# EAGLE design BMS-Shield rev4 (EAGLE 8.2.2)
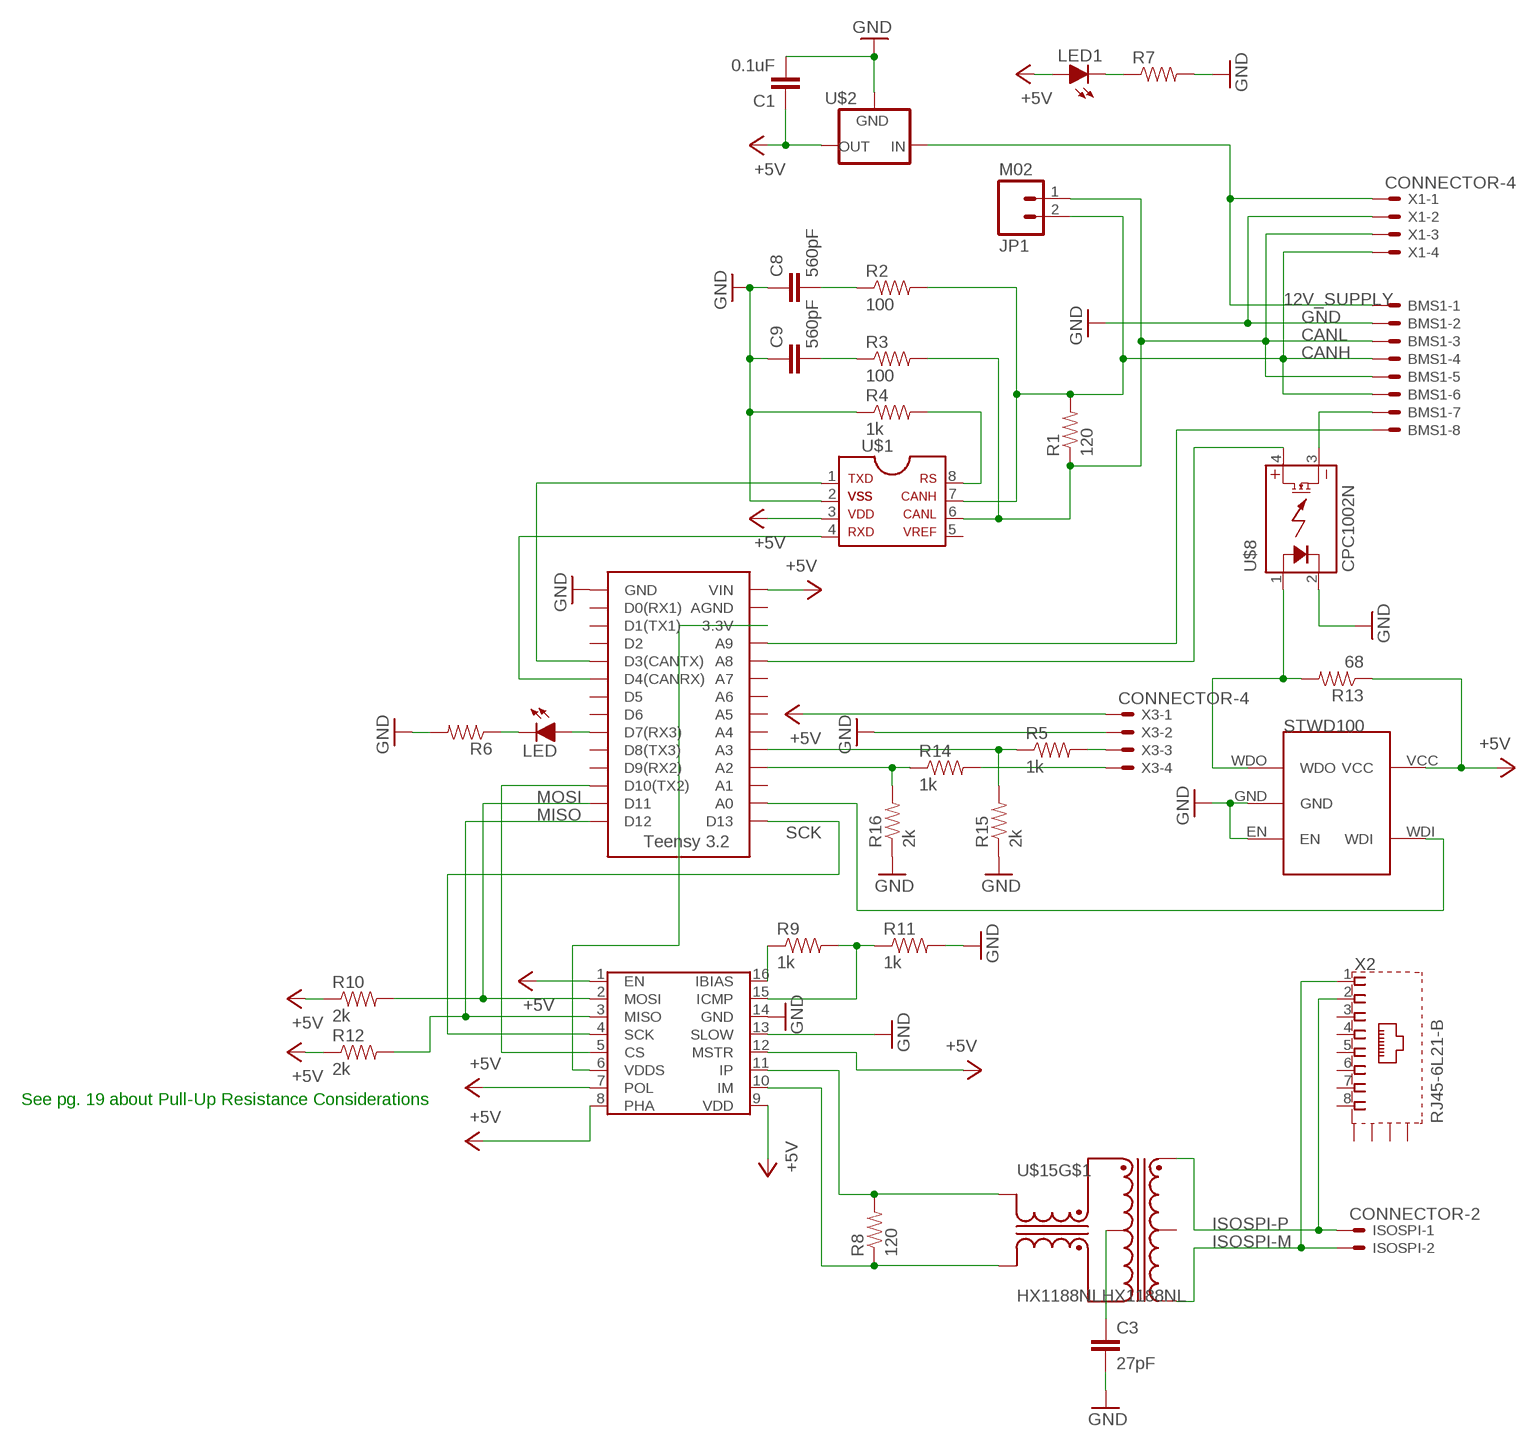
[diagram p0: schematic, sheet 1]

## Parts
BMS1  MINIFIT_5566-8  [MINIFIT_5566-8]
C1  0.1uF  CAP0805  [0805]
C3  27pF  CAP0805  [0805]
C8  560pF  CAP0805  [0805]
C9  560pF  CAP0805  [0805]
ISOSPI  CONNECTOR-2  [MINIFIT_5566-2]
JP1  M02  [1X02]
LED  LED-0805  [LED-805]
LED1  LED-0805  [LED-805]
R1  120  RESISTOR0805-RES  [0805]
R2  100  RESISTOR0805-RES  [0805]
R3  100  RESISTOR0805-RES  [0805]
R4  1k  RESISTOR0805-RES  [0805]
R5  1k  RESISTOR0805-RES  [0805]
R6  RESISTOR0805-RES  [0805]
R7  RESISTOR0805-RES  [0805]
R8  120  RESISTOR0805-RES  [0805]
R9  1k  RESISTOR0805-RES  [0805]
R10  2k  RESISTOR0805-RES  [0805]
R11  1k  RESISTOR0805-RES  [0805]
R12  2k  RESISTOR0805-RES  [0805]
R13  68  RESISTOR0805-RES  [0805]
R14  1k  RESISTOR0805-RES  [0805]
R15  2k  RESISTOR0805-RES  [0805]
R16  2k  RESISTOR0805-RES  [0805]
U$1  MCP2551  [SOIC-08]
U$2  5VREG_LM340-NLM340MPX-5.0/NOPB  [SOT223]
U$3  STWD100  [SOT23-5]
U$6  LTC6820  [MSOP-16]
U$7  TEENSY_3.2_SIMPLE  [TEENSY_3.2_SIMPLE]
U$8  CPC1002N  [SOP04]
U$15  HX1188NLHX1188NL  [HX1188NL]
X1  CONNECTOR-4  [MINIFIT_5566-4]
X2  RJ45-6L21-B  [RJ45-SHIELD1]
X3  CONNECTOR-4  [MINIFIT_5566-4]

## Nets
12V_SUPPLY: BMS1.1 U$2.1(IN) X1.1
+5V: C1.1 LED1.A R10.1 R12.1 R13.1 U$1.3 U$2.3(OUT) U$3.VCC U$6.1(EN) U$6.7(POL) U$6.8(PHA) U$6.9(VDD) U$6.12(MSTR) U$7.VIN X3.1
CANH: BMS1.4 BMS1.6 JP1.2 R1.2 R2.2 U$1.7 X1.4
CANL: BMS1.3 BMS1.5 JP1.1 R1.1 R3.2 U$1.6 X1.3
GND: BMS1.2 C1.2 C3.2 C8.1 C9.1 R4.1 R6.2 R7.2 R11.2 R15.1 R16.1 U$1.2 U$2.2(GND) U$2.4(GND) U$3.EN U$3.GND U$6.13(SLOW) U$6.14(GND) U$7.GND U$8.2(CONTROL-) X1.2 X3.2
ISOSPI-M: ISOSPI.2 U$15.3(D-) X2.1
ISOSPI-P: ISOSPI.1 U$15.1(D+) X2.2
MISO: R12.2 U$6.3(MISO) U$7.D12
MOSI: R10.2 U$6.2(MOSI) U$7.D11
N$1: R5.2 X3.3
N$2: U$1.4 U$7.D4(CANRX)
N$3: LED.A U$7.D7(RX3)
N$4: U$6.6(VDDS) U$7.3.3V
N$5: R5.1 R15.2 U$7.A3
N$6: R14.2 X3.4
N$7: BMS1.7 U$8.3(DC-)
N$8: R14.1 R16.2 U$7.A2
N$9: U$3.WDI U$7.A0
N$10: R13.2 U$3.WDO U$8.1(CONTROL+)
N$11: U$7.A8 U$8.4(DC+)
N$12: U$1.1 U$7.D3(CANTX)
N$13: BMS1.8 U$7.A9
N$14: C8.2 R2.1
N$15: U$6.5(CS) U$7.D10(TX2)
N$16: R4.2 U$1.8
N$17: C9.2 R3.1
N$18: LED.C R6.1
N$22: LED1.C R7.1
N$25: R9.1 U$6.16(IBIAS)
N$26: R9.2 R11.1 U$6.15(ICMP)
N$29: R8.1 U$6.10(IM) U$15.14(X-)
N$30: R8.2 U$6.11(IP) U$15.16(X+)
N$31: C3.1 U$15.15(CX)
SCK: U$6.4(SCK) U$7.D13
Unconnected: U$1.5 U$7.A1 U$7.A4 U$7.A5 U$7.A6 U$7.A7 U$7.AGND U$7.D0(RX1) U$7.D1(TX1) U$7.D2 U$7.D5 U$7.D6 U$7.D8(TX3) U$7.D9(RX2) U$15.2(CD) U$15.6(D+) U$15.7(CD) U$15.8(D-) U$15.9(X-) U$15.10(CX) U$15.11(X+) X2.3 X2.4 X2.5 X2.6 X2.7 X2.8 X2.S1(S) X2.S2(S) X2.S3(S) X2.S4(S)

## Notes on the sheet
- See pg. 19 about Pull-Up Resistance Considerations

## Library data of the parts
BMS1 = HyTechDevices:MINIFIT_5566-8: Mini-Fit Junior connector 8 pole Source: http://www.molex.com; OC_FARNELL: unknown; OC_NEWARK: unknown
C1 C3 C8 C9 = HyTechDevices:CAP: Capacitor Standard 0603 ceramic capacitor, and 0.1" leaded capacitor.
ISOSPI = HyTechDevices:CONNECTOR-2: Mini-Fit Junior connector 2 pole Source: http://www.molex.com; OC_FARNELL: 1822072; OC_NEWARK: unknown
JP1 = HyTechDevices:M02: Standard 2-pin 0.1" header. NOTES ON THE VARIANTS LOCK and LOCK_LONGPADS... This footprint was designed to help hold the alignment of a through-hole component (i.e. 6-pin header) while soldering it into place. You may notice that each hole has been shifted either up or down by 0.005 of an inch from it's more standard position (which is a perfectly straight line). This slight alteration caused the pins (the squares in the middle) to touch the edges of the holes. Because they are alternating, it causes a "brace" to hold the component in place. 0.005 has proven to be the perfect amount of "off-center" position when using our standard breakaway headers. Although looks a little odd when you look at the bare footprint, once you have a header in there, the alteration is very hard to notice. Also,if you push a header all the way into place, it is covered up entirely on the bottom side. This idea of altering the position of holes to aid alignment will be further integrated into the Sparkfun Library for other footprints. It can help hold any component with 3 or more connection pins. Note: The Sparkfun version includes many other packages including surface mount that may be of future interest. Source: Sparkfun <https://github.com/sparkfun/SparkFun-Eagle-Libraries>
LED LED1 = HyTechDevices:LED: Light Emitting Diode (LED) Source: Dangerous Prototypes Eagle Library <https://github.com/DangerousPrototypes/Eagle_Part_Library>
R1-R16 = HyTechDevices:RESISTOR: Resistor Basic schematic elements and footprints for 0603, 1206, and PTH resistors.
U$1 = HyTechDevices:MCP2551: MCP2551 High-Speed CAN Transceiver Product Webpage <https://www.microchip.com/wwwproducts/en/MCP2551> Datasheet <http://ww1.microchip.com/downloads/en/DeviceDoc/21667f.pdf> This device is outdated It is replaced by MCP2561. Comparison Page <https://www.microchip.com/wwwproducts/ProductCompare/MCP2551/MCP2561> Product Webpage <https://www.microchip.com/wwwproducts/en/MCP2561> Datasheet <http://ww1.microchip.com/downloads/en/DeviceDoc/20005167C.pdf>
U$2 = HyTechDevices:5VREG_LM340-N: Voltage Regulator 5v linear voltage regulator Datasheet <http://www.mouser.com/ProductDetail/Texas-Instruments/LM340MPX-50-NOPB/?qs=X1J7HmVL2ZGZwtTFRQ9ItA%3D%3D> MAX current out: 1.5A MAX voltage in: 35V
U$3 = HyTechDevices:STWD100: STWD100 Watchdog timer
U$6 = HyTechDevices:LTC6820
U$7 = HyTechDevices:TEENSY_3.2_SIMPLE: Simple version of the Teensy 3.2 board that only uses the 2 main rows of pins, not the inner pins or the pins opposite the usb port.
U$8 = HyTechDevices:CPC1002N: IXYS Solid State Relay .7A
U$15 = HyTechDevices:HX1188NL: Pulse Electronics HX1188NL Transformer
X1 X3 = HyTechDevices:CONNECTOR-4: Mini-Fit Junior connector 4 pole Source: http://www.molex.com; OC_FARNELL: unknown; OC_NEWARK: unknown
X2 = con-tycoelectronics:RJ45*2: RJ45 Low Profile Shield Type 2 For all RJ45 L, LC, LCT and X Series Models Source: www.tycoelectronics.com .. ENG_DS_1654001_1099_RJ_L_0507.pdf; OC_FARNELL: unknown; OC_NEWARK: unknown

## Board
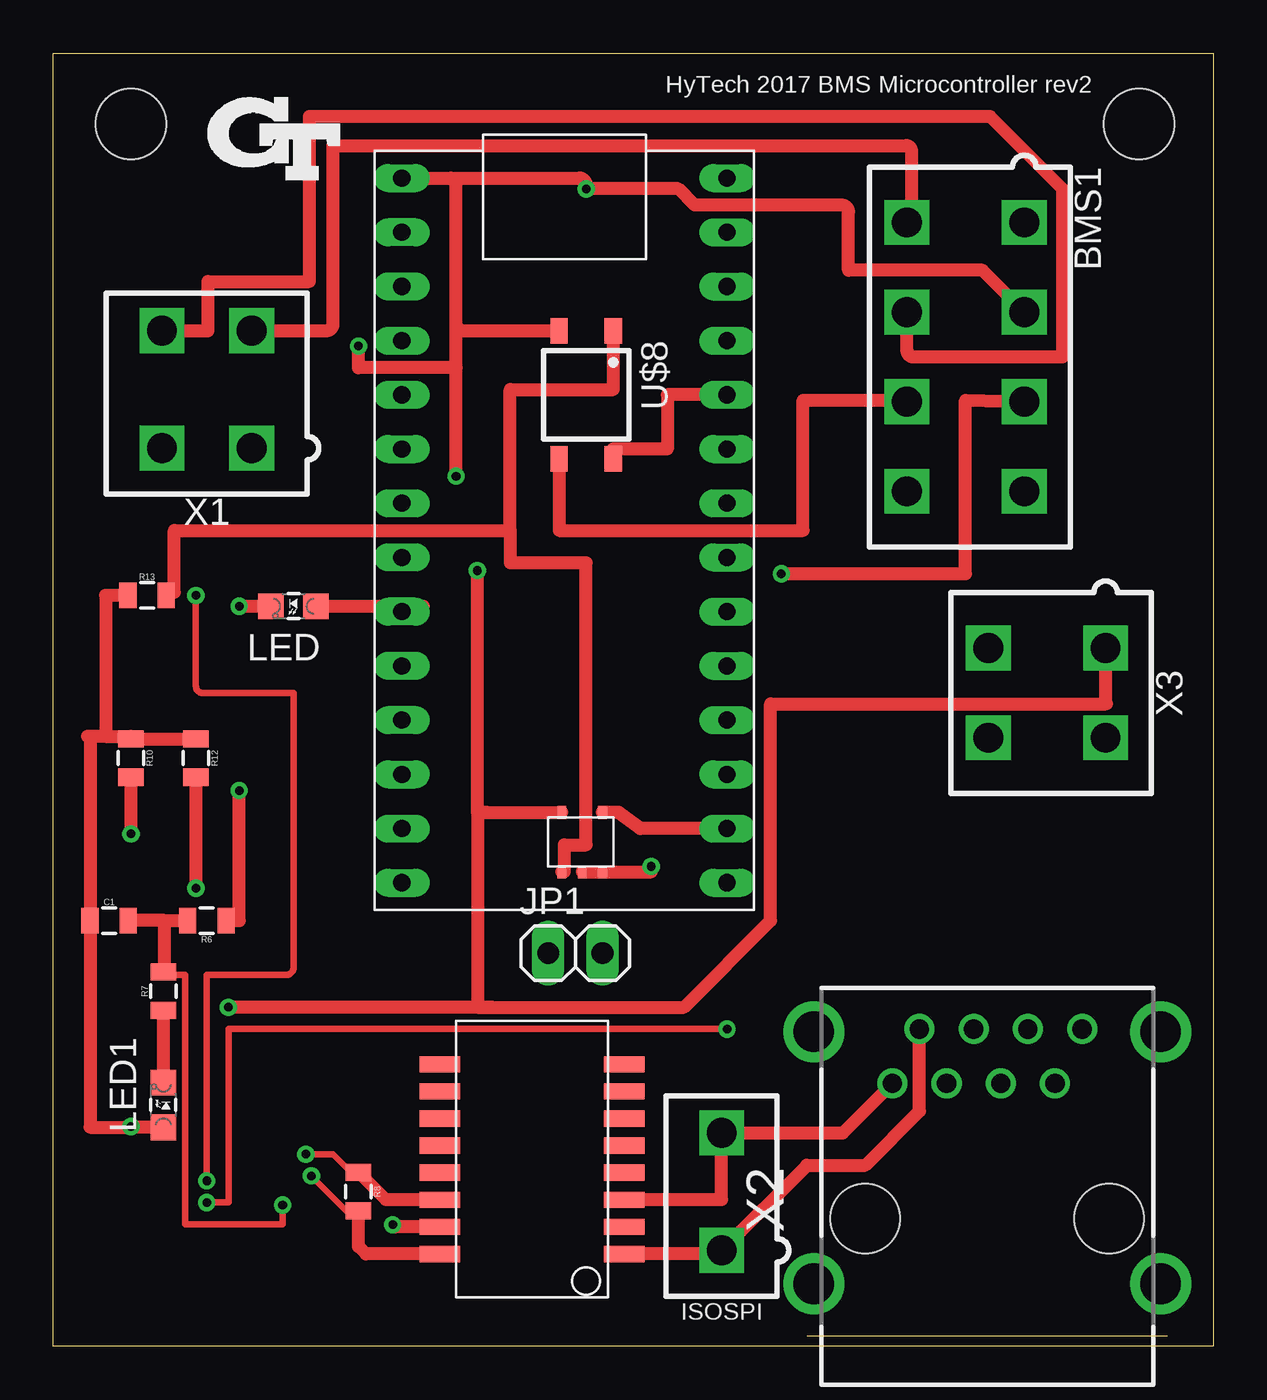
[diagram p1: board, top side]
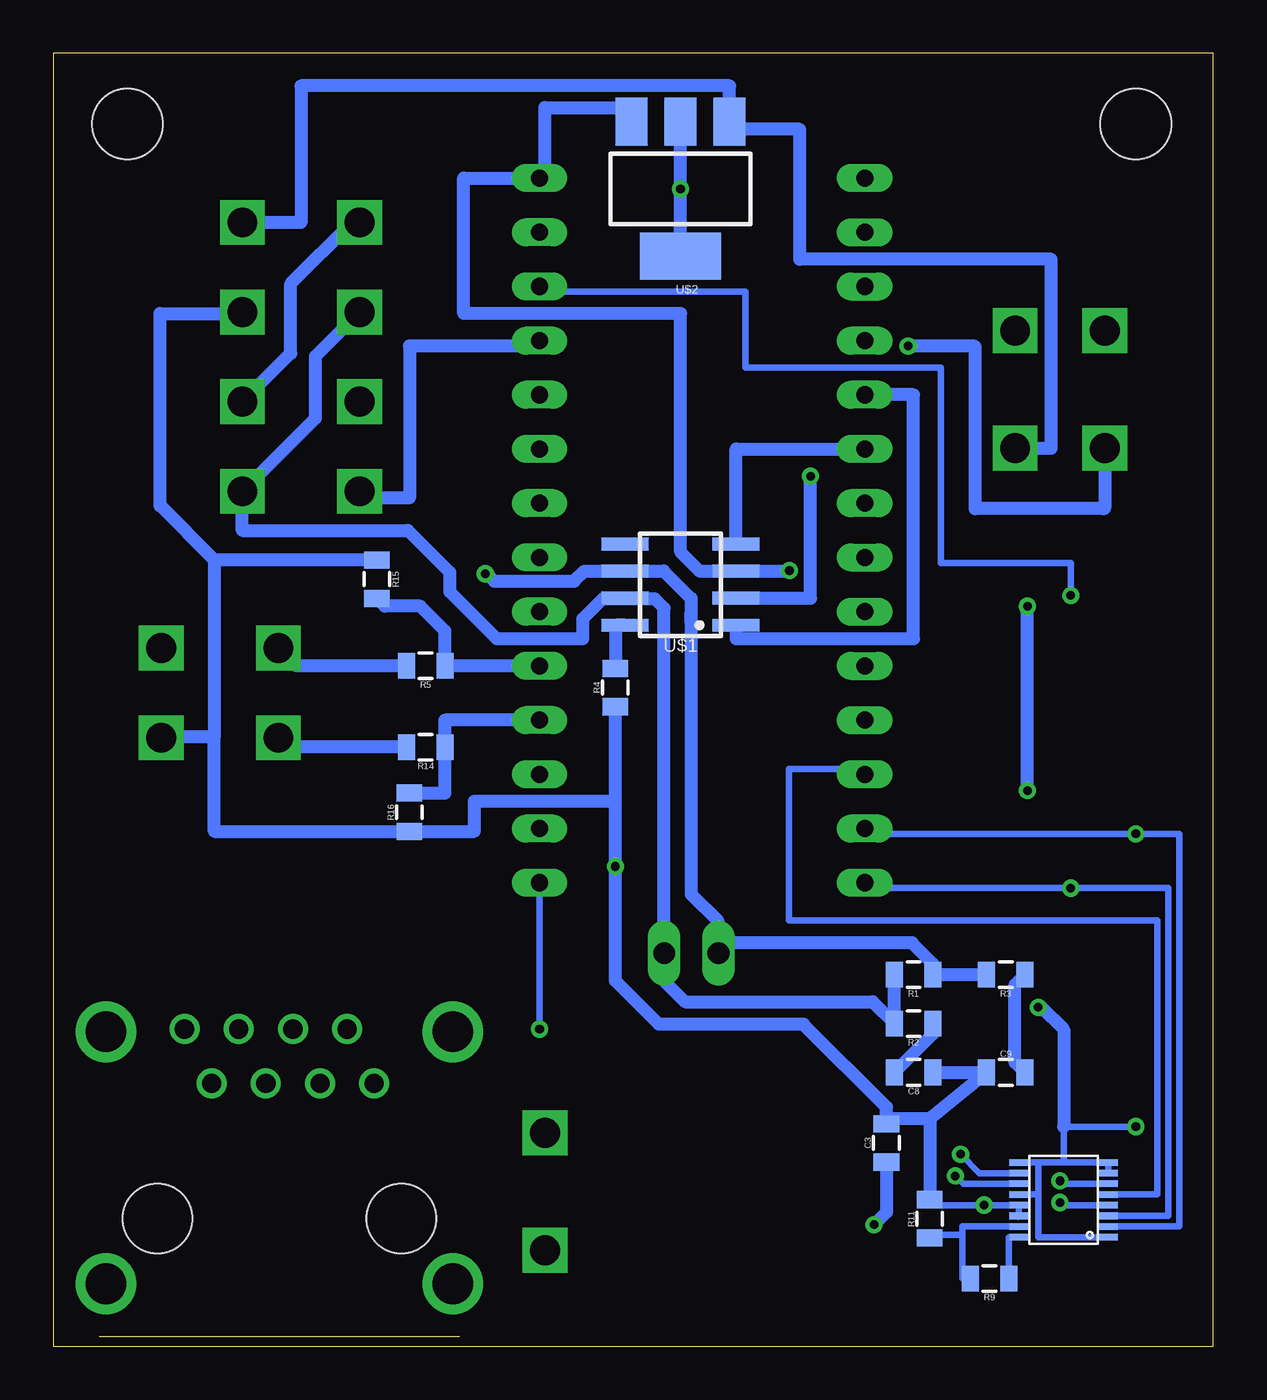
[diagram p2: board, bottom side, seen from below]

Size 54.36 x 60.58 mm. Coordinates in mm from the lower left corner, seen from the top.
Outline: 0,60.58 54.36,60.58 54.36,0 0,0 0,60.58
Copper layers (1*16): Top 0.035mm / dielectric 1.5mm / Bottom 0.035mm
Design rules "default *": minimum track width 6mil, minimum drill 15mil, track to track 6mil, track to pad 6mil, pad to pad 6mil, via to via 6mil, smd to smd 6mil, copper to edge 6mil, drill to drill 15mil, minimum pad ring 10mil, minimum via ring 8mil, stop-mask expansion 4mil, vias tented up to drill 0mil, thermal gap 10mil
Holes 3.3 mm at 3.63,57.28 50.88,57.28

### Footprints (pad centres in the part's own frame; a part is rotated, then mirrored left to right if it is on the bottom)
MINIFIT_5566-8 = drill 1.4 square: 1 6.3,-2.75; 2 2.1,-2.75; 3 -2.1,-2.75; 4 -6.3,-2.75; 5 6.3,2.75; 6 2.1,2.75; 7 -2.1,2.75; 8 -6.3,2.75
0805 = smd 0.8 x 1.2: 1 -0.9,0; 2 0.9,0
MINIFIT_5566-2 = drill 1.4 square: 1 0,-2.75; 2 0,2.75
1X02 = drill 1.016 long: 1 -1.27,0; 2 1.27,0
LED-805 = smd 1.2 x 1.2: A 0,-1.05; C 0,1.05
SOIC-08 = smd 0.6 x 2.2: 1 -1.905,-2.6; 2 -0.635,-2.6; 3 0.635,-2.6; 4 1.905,-2.6; 5 1.905,2.6; 6 0.635,2.6; 7 -0.635,2.6; 8 -1.905,2.6
SOT223 = smd 1.5 x 2.235: 1 -2.3,-3.15; 2 0,-3.15; 3 2.3,-3.15 | smd 3.8 x 2.2: 4 0,3.15
SOT23-5 = smd 0.61 x 0.406: EN -2.794,0; GND -2.794,0.94; VCC 0,1.905; WDI 0,0; WDO -2.794,1.905
MSOP-16 = smd 0.305 x 0.889: 1 -0.1,-0.5; 2 0.4,-0.5; 3 0.9,-0.5; 4 1.4,-0.5; 5 1.9,-0.5; 6 2.4,-0.5; 7 2.9,-0.5; 8 3.4,-0.5; 9 3.4,3.7; 10 2.9,3.7; 11 2.4,3.7; 12 1.9,3.7; 13 1.4,3.7; 14 0.9,3.7; 15 0.4,3.7; 16 -0.1,3.7
TEENSY_3.2_SIMPLE = drill 0.8 long: 3.3V 16.51,29.21; A0 16.51,3.81; A1 16.51,6.35; A2 16.51,8.89; A3 16.51,11.43; A4 16.51,13.97; A5 16.51,16.51; A6 16.51,19.05; A7 16.51,21.59; A8 16.51,24.13; A9 16.51,26.67; AGND 16.51,31.75; D0(RX1) 1.27,31.75; D1(TX1) 1.27,29.21; D2 1.27,26.67; D3(CANTX) 1.27,24.13; D4(CANRX) 1.27,21.59; D5 1.27,19.05; D6 1.27,16.51; D7(RX3) 1.27,13.97; D8(TX3) 1.27,11.43; D9(RX2) 1.27,8.89; D10(TX2) 1.27,6.35; D11 1.27,3.81; D12 1.27,1.27; D13 16.51,1.27; GND 1.27,34.29; VIN 16.51,34.29
SOP04 = smd 0.8 x 1.2: 1 -1.27,-3; 2 1.27,-3; 3 1.27,3; 4 -1.27,3
HX1188NL = smd 1.905 x 0.762: 1 -4.318,4.445; 2 -4.318,3.175; 3 -4.318,1.905; 4 -4.318,0.635; 5 -4.318,-0.635; 6 -4.318,-1.905; 7 -4.318,-3.175; 8 -4.318,-4.445; 9 4.318,-4.445; 10 4.318,-3.175; 11 4.318,-1.905; 12 4.318,-0.635; 13 4.318,0.635; 14 4.318,1.905; 15 4.318,3.175; 16 4.318,4.445
MINIFIT_5566-4 = drill 1.4 square: 1 2.1,-2.75; 2 -2.1,-2.75; 3 2.1,2.75; 4 -2.1,2.75
RJ45-SHIELD1 = drill 0.9 pad 1.4: 1 -4.445,6.35; 2 -3.175,8.89; 3 -1.905,6.35; 4 -0.635,8.89; 5 0.635,6.35; 6 1.905,8.89; 7 3.175,6.35; 8 4.445,8.89 | drill 1.9 pad 2.5: S1 -8.128,-3.048; S2 8.128,-3.048; S3 -8.128,8.76; S4 8.128,8.76 | hole 3.251: -5.715,0; 5.715,0

### Placement (x,y rotation side)
BMS1  42.75,46.35 90 top
C1  2.62,19.94 0 top
C3  15.32,9.53 90 bottom
C8  14.05,12.83 180 bottom
C9  9.73,12.83 0 bottom
ISOSPI  31.32,7.24 0 top
JP1  24.46,18.41 0 top
LED  11.25,34.67 90 top
LED1  5.16,11.3 0 top
R1  14.05,17.4 180 bottom
R2  14.05,15.11 180 bottom
R3  9.73,17.4 180 bottom
R4  28.02,30.86 90 bottom
R5  36.91,31.88 180 bottom
R6  7.19,19.94 180 top
R7  5.16,16.64 90 top
R8  14.3,7.24 270 top
R9  10.49,3.17 180 bottom
R10  3.63,27.56 270 top
R11  13.28,5.97 90 bottom
R12  6.68,27.56 270 top
R13  4.39,35.18 0 top
R14  36.91,28.07 180 bottom
R15  39.19,35.94 270 bottom
R16  37.67,25.02 90 bottom
U$1  24.97,35.69 90 bottom
U$2  24.97,54.23 180 bottom
U$3  25.73,25.02 90 top
U$6  5.41,5.21 90 bottom
U$7  15.06,20.45 0 top
U$8  24.97,44.58 180 top
U$15  22.43,8.76 180 top
X1  7.19,44.83 0 top
X2  43.76,5.97 0 top
X3  46.56,30.61 90 top

### Tracks (layer width: path | path; a pad name or v marks a point on that pad's centre or on a via)
12V_SUPPLY
  Bottom 0.61: BMS1.1 42.75,52.66 42.75,59.05 22.67,59.05 U$2.1 22.94,57.38 22.94,57.02 19.38,57.02 19.38,50.93 7.59,50.93 7.59,42.08 X1.1
+5V  (via drill 0.4)
  Top 0.61: 2.45,28.57 1.6,28.57 arc-90 1.72,28.46 C1.1 1.72,10.25 3.6,10.25 arc90 v3.63,10.29 | 2.45,28.57 3.63,28.57 R10.1 R12.1 | R13.1 2.45,35.18 2.45,28.57 | 20.57,15.88 29.54,15.88 33.6,19.94 33.6,30.1 49.31,30.1 | 20.57,15.88 v8.2,15.88 | 20.32,25.02 U$3.VCC | 20.32,25.02 19.89,25.02 19.89,15.88 20.57,15.88 | v3.63,10.29 3.56,10.29 | LED1.A 3.67,10.25 arc-90 v3.63,10.29 | 49.35,30.1 49.31,30.1 | 49.31,30.1 X3.1 | v19.86,36.34 19.86,25.02 20.32,25.02
  Bottom 0.305: 8.2,7.11 U$6.12 | 8.2,7.11 8.2,8.61 | U$6.1 8.2,5.11 8.2,7.11 | v3.63,10.29 7.01,10.29 7.01,8.61 | U$6.7 U$6.8 7.01,8.61 | U$1.3 21.73,36.32 21.73,36.2 | U$6.9 8.2,8.61 | 7.01,8.61 8.2,8.61
  Bottom 0.61: U$2.3 27.27,58.04 31.32,58.04 31.32,54.74 U$7.VIN 35.13,54.74 35.13,48.39 24.97,48.39 24.97,37.21 24.08,36.32 U$1.3 19.86,36.32 | 19.81,36.32 19.86,36.32 | 19.86,36.32 v19.86,36.34 | v8.2,15.88 8.05,15.88 7.01,14.83 7.01,10.29
CANH
  Top 0.61: BMS1.6 40,46.67 arc90 40.32,46.35 47.3,46.35 47.31,54.2 43.9,57.62 11.99,57.62 11.99,49.89 7.25,49.89 7.25,47.58 X1.4
  Bottom 0.61: 27.57,35.02 U$1.7 28.57,35.05 29.54,34.09 29.54,33.15 33.58,33.15 35.79,35.36 35.79,36.27 37.74,38.23 45.5,38.23 BMS1.4 42.07,43.49 42.07,46.39 BMS1.6 | 27.57,35.02 28.54,35.02 | R1.2 R2.2 15.97,16.14 24.75,16.14 25.73,17.12 JP1.2 25.73,34.58 26.17,35.02 27.57,35.02
CANL  (via drill 0.4)
  Top 0.61: v34.11,36.2 42.75,36.2 42.75,44.32 BMS1.3 | BMS1.5 40.21,52.66 40.21,56.01 arc90 39.95,56.26 13.11,56.26 13.11,47.9 arc-90 12.79,47.58 X1.3
  Bottom 0.61: v34.11,36.2 34.08,36.22 33.7,35.85 29.95,35.85 29.48,36.32 U$1.6 25.76,36.32 24.47,35.03 24.47,33.91 | 24.47,33.91 24.47,34.39 | 24.47,33.91 24.47,21.17 23.19,19.89 JP1.1 22.71,18.9 14.12,18.9 13.15,17.92 R1.1 R3.2 | BMS1.3 43.23,46.52 43.23,49.78 40.36,52.66 BMS1.5
GND  (via drill 0.4)
  Top 0.305: R7.2 5.29,17.4 6.17,17.4 6.17,5.71 10.74,5.71 v10.74,6.61
  Top 0.61: U$3.GND U$3.EN 28.02,22.23 v28.02,22.48 | 5.22,19.94 C1.2 | 5.22,19.94 R6.2 | U$8.2 19.11,47.58 18.87,47.82 | U$7.GND 18.62,54.74 | 18.62,54.74 18.87,54.48 18.87,47.82 | v18.87,40.77 18.87,45.85 | 18.87,45.85 18.87,47.82 | 18.62,54.74 24.65,54.74 arc-90 24.97,54.42 v24.97,54.23 29.29,54.23 30.05,53.47 36.94,53.47 arc-90 37.26,53.15 37.26,50.42 43.53,50.42 BMS1.2 | 18.87,45.85 14.3,45.85 v14.3,46.86 | R7.2 5.22,17.54 5.22,19.94
  Bottom 0.305: 9.15,6.06 U$6.14 U$6.13 v10.74,6.61 13.28,6.61 R11.2
  Bottom 0.61: BMS1.2 45.48,48.64 45.48,48.39 49.35,48.39 49.35,39.38 46.81,36.84 | U$2.4 v24.97,54.23 U$2.2 | C8.1 C9.1 13.28,10.68 | R15.1 46.81,36.84 | 46.81,28.57 49.31,28.57 X3.2 | 46.81,36.84 46.81,28.57 | 46.81,28.57 46.81,24.12 R16.1 34.62,24.12 34.62,25.53 28.02,25.53 | 28.02,25.53 R4.1 | 28.02,25.53 v28.02,22.48 28.02,17.12 25.98,15.09 19.2,15.09 15.32,11.2 C3.2 15.06,10.68 13.28,10.68 | U$1.2 18.87,35.05 v18.87,40.77 | X1.2 5.09,39.31 arc90 5.16,39.24 11.15,39.24 11.15,46.76 arc-90 11.25,46.86 v14.3,46.86 | 13.28,10.68 R11.2
ISOSPI-M
  Top 0.61: U$15.3 31.32,6.86 ISOSPI.2 36.99,9.99 X2.1
ISOSPI-P
  Top 0.61: X2.2 40.59,11.02 38.05,8.48 35.31,8.48 ISOSPI.1 31.15,4.32 U$15.1
MISO  (via drill 0.4)
  Top 0.61: R12.2 v6.68,21.46
  Bottom 0.305: U$6.3 2.11,6.11 2.11,21.46 v6.68,21.46 16.33,21.46 U$7.D12
MOSI  (via drill 0.4)
  Top 0.61: R10.2 v3.63,24
  Bottom 0.305: U$6.2 1.6,5.61 1.6,24 v3.63,24 16.33,24 U$7.D11
N$1
  Bottom 0.61: R5.2 42.98,31.88 X3.3
N$2
  Bottom 0.61: U$1.4 22.37,42.04 U$7.D4(CANRX)
N$3
  Top 0.61: LED.A 17.35,34.67 U$7.D7(RX3)
N$4  (via drill 0.4)
  Top 0.305: v7.19,7.75 7.19,17.4 10.94,17.4 arc90 11.25,17.72 11.25,30.61 7,30.61 | 7,30.61 arc-90 6.68,30.92 | 7,30.61 arc-90 6.68,30.92 | 6.68,30.92 v6.68,35.18
  Bottom 0.305: v6.68,35.18 6.68,36.7 12.78,36.7 12.78,45.85 21.92,45.85 21.92,49.4 31.32,49.4 arc90 U$7.3.3V | v7.19,7.75 arc-90 7.05,7.61 U$6.6
N$5
  Bottom 0.61: U$7.A3 R5.1 36.01,33.52 37.16,34.67 38.82,34.67 R15.2
N$6
  Bottom 0.61: R14.2 43.81,28.07 X3.4
N$7
  Top 0.61: U$8.3 23.7,38.23 35.13,38.23 35.13,44.32 40,44.32 BMS1.7
N$8
  Bottom 0.61: U$7.A2 36.01,29.34 R14.1 36.01,25.92 R16.2
N$9
  Top 0.61: U$7.A0 27.51,24.26 26.49,25.02 U$3.WDI
N$10
  Top 0.61: U$3.WDO 23.95,22.23 23.95,23.5 24.97,23.5 24.97,36.7 21.41,36.7 21.41,38.23 | 21.41,38.23 21.41,44.83 26.24,44.83 U$8.1 | R13.2 arc-90 5.66,35.32 5.66,38.23 21.41,38.23
N$11
  Top 0.61: U$7.A8 28.78,44.58 28.78,42.04 26.24,42.04 U$8.4
N$12
  Bottom 0.61: U$1.1 22.37,33.15 14.05,33.15 14.05,44.58 U$7.D3(CANTX)
N$13
  Bottom 0.61: U$7.A9 arc90 31.83,46.86 37.67,46.86 37.67,39.75 40.72,39.75 arc90 40.41,40.05 BMS1.8
N$14
  Bottom 0.61: C8.2 13.15,14.63 R2.1
N$15
  Bottom 0.305: U$6.5 2.62,7.11 2.62,19.94 19.89,19.94 19.89,27.05 16.33,27.05 U$7.D10(TX2)
N$16
  Bottom 0.61: U$1.8 28.02,33.78 R4.2
N$17
  Bottom 0.61: R3.1 9.3,16.93 9.3,13.29 C9.2
N$18  (via drill 0.4)
  Top 0.61: R6.1 8.71,19.94 v8.71,26.04 | v8.71,34.67 LED.C
  Bottom 0.61: v8.71,26.04 v8.71,34.67
N$22
  Top 0.61: R7.1 LED1.C
N$25
  Bottom 0.305: R9.1 9.59,5.11 U$6.16
N$26
  Bottom 0.305: U$6.15 11.76,5.61 11.76,5.21 | 11.76,5.21 13.28,5.21 R11.1 | R9.2 11.76,3.17 11.76,5.21
N$29  (via drill 0.4)
  Top 0.305: v11.84,8.99 13.11,8.99 13.96,8.14 R8.1
  Top 0.61: U$15.14 15.58,6.86 R8.1
  Bottom 0.305: U$6.10 10.95,8.11 v11.84,8.99
N$30  (via drill 0.4)
  Top 0.305: R8.2 13.73,6.34 v12.09,7.98
  Top 0.61: R8.2 14.3,4.67 14.66,4.32 U$15.16
  Bottom 0.305: U$6.11 11.72,7.61 v12.09,7.98
N$31  (via drill 0.4)
  Top 0.61: U$15.15 16,5.59 v15.9,5.69
  Bottom 0.61: v15.9,5.69 15.32,6.27 C3.1
SCK  (via drill 0.4)
  Top 0.305: v7.19,6.73 8.2,6.73 8.2,14.86 v31.57,14.86
  Bottom 0.305: U$6.4 7.19,6.61 v7.19,6.73 | v31.57,14.86 U$7.D13

### Text on the board
tPlace: HyTech 2017 BMS Microcontroller rev2